# Altium schematic sheet FlyBack.SchDoc
size A4
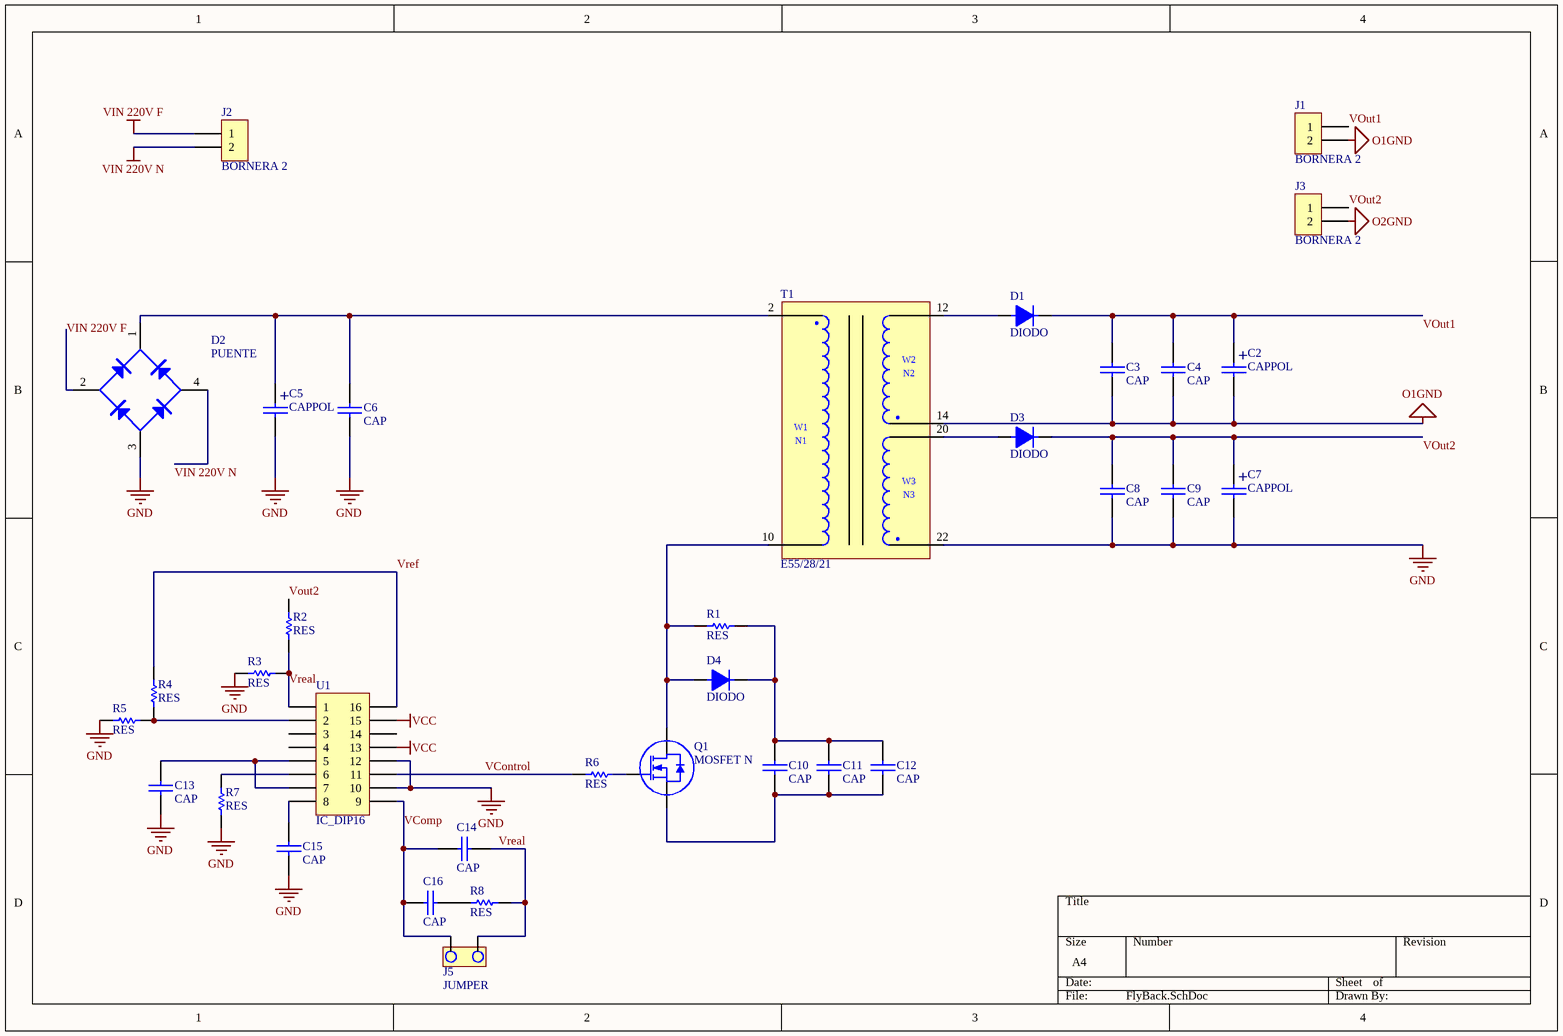
[diagram p0: FlyBack.SchDoc]

## Parts
C2  CAPPOL  [CAP300RP]
C3  CAP  [CAP200]
C4  CAP  [CAP200]
C5  CAPPOL  [CAP300RP]
C6  CAP  [CAP200]
C7  CAPPOL  [CAP300RP]
C8  CAP  [CAP200]
C9  CAP  [CAP200]
C10  CAP  [CAP200]
C11  CAP  [CAP200]
C12  CAP  [CAP200]
C13  CAP  [CAP200]
C14  CAP  [CAP200]
C15  CAP  [CAP200]
C16  CAP  [CAP200]
D1  DIODO  [DO41]
D2  PUENTE  [PUENTE - W10M]
D3  DIODO  [DO41]
D4  DIODO  [DO41]
J1  BORNERA 2  [BORNERA2]
J2  BORNERA 2  [BORNERA2]
J3  BORNERA 2  [BORNERA2]
J5  JUMPER  [JUMPER2]
Q1  MOSFET N  [TO-220 V]
R1  RES  [RES400]
R2  RES  [RES400]
R3  RES  [RES400]
R4  RES  [RES400]
R5  RES  [RES400]
R6  RES  [RES400]
R7  RES  [RES400]
R8  RES  [RES400]
T1  E55/28/21  [E55/28/21]
U1  IC_DIP16  [DIP16]

## Nets
GND: C5.2 C6.2 C7.2 C8.2 C9.2 C13.2 C15.2 D2.3(V-) R3.1 R5.1 R7.1 T1.22 U1.10 U1.12
O1GND: C2.2 C3.2 C4.2 J1.2 T1.14
O2GND: J3.2
VCC: U1.13 U1.15
VIN 220V F: D2.2(AC) J2.1
VIN 220V N: D2.4(AC) J2.2
VComp: C14.1 C16.1 J5.1 U1.9
VControl: R6.1 U1.11
VOut1: C2.1 C3.1 C4.1 D1.2 J1.1
VOut2: C7.1 C8.1 C9.1 D3.2 J3.1 R2.2
Vreal: C14.2 J5.2 R2.1 R3.2 R8.1 U1.1
Vref: R4.2 U1.16
NetC5_1: C5.1 C6.1 D2.1(V+) T1.2
NetC10_1: C10.1 C11.1 C12.1 Q1.3(S)
NetC10_2: C10.2 C11.2 C12.2 D4.2 R1.2
NetC13_1: C13.1 U1.5 U1.7
NetC15_1: C15.1 U1.8
NetC16_2: C16.2 R8.2
NetD1_1: D1.1 T1.12
NetD3_1: D3.1 T1.20
NetD4_1: D4.1 Q1.2(D) R1.1 T1.10
NetQ1_1: Q1.1(G) R6.2
NetR4_1: R4.1 R5.2 U1.2
NetR7_2: R7.2 U1.6

Not connected (* = marked no-connect by the designer): U1 3 4 14

## Notes on the sheet
- (in symbol CAPPOL) +
- (in symbol E55/28/21) W2; N2; W1; N1; W3; N3

## Library data of the parts
T1 = E55/28/21: Transistor E55/28/21